# Altium schematic sheet MCS_adapter.SchDoc
size A4
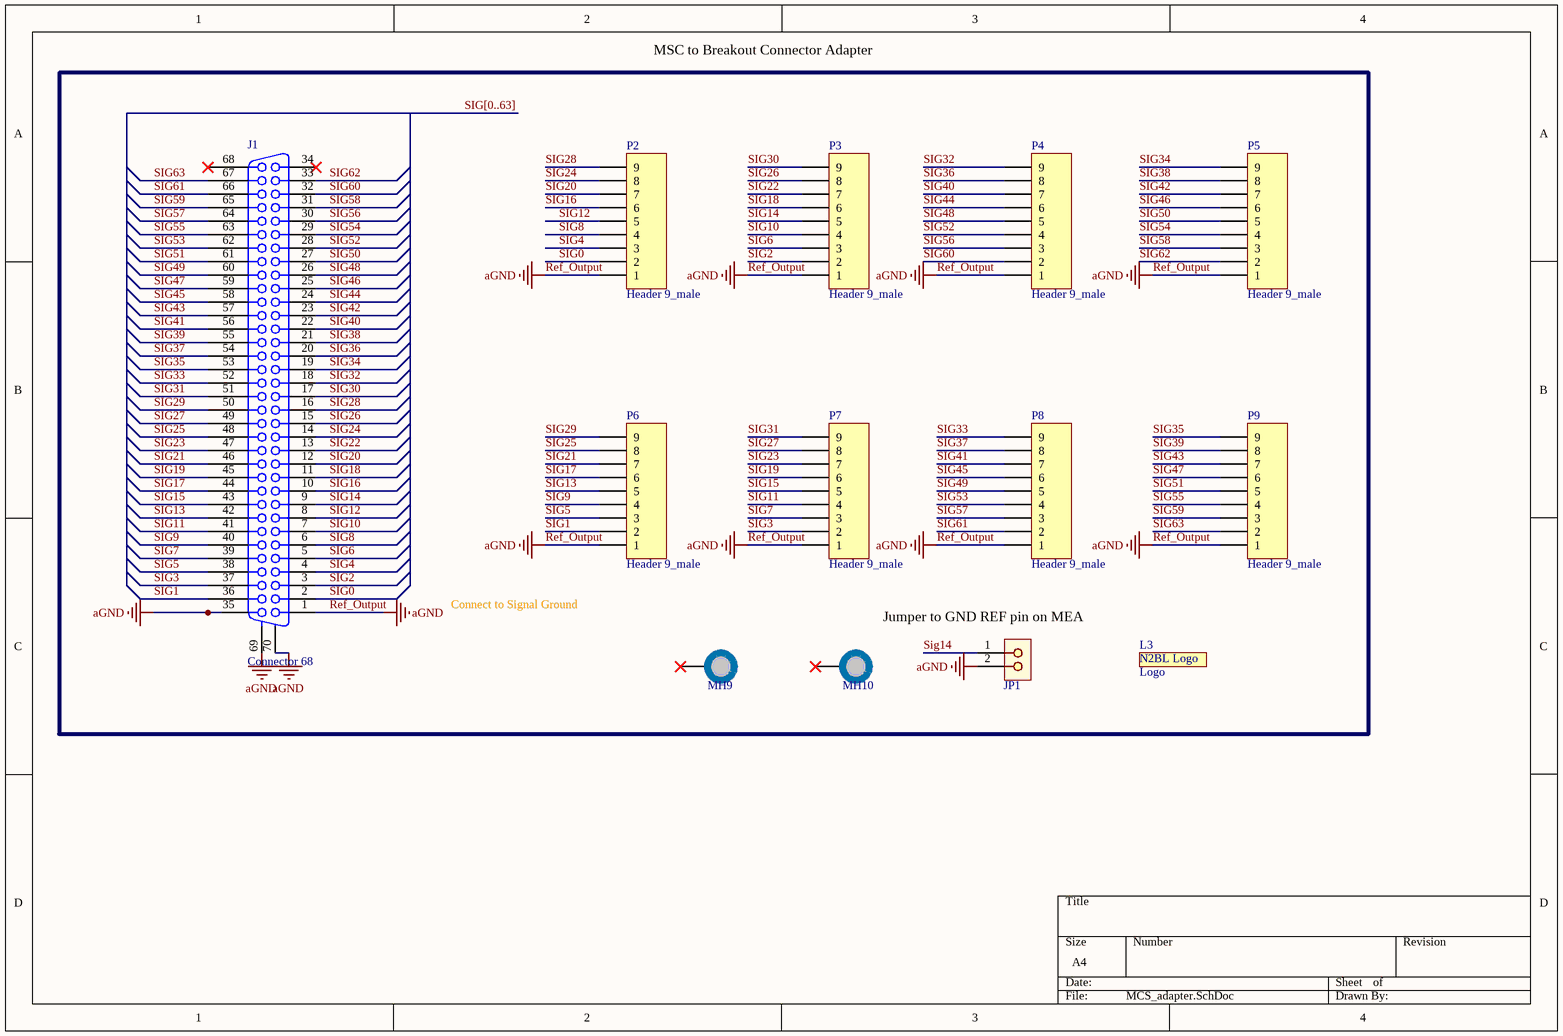
[diagram p0: MCS_adapter.SchDoc]

## Parts
J1  Connector 68  [CONN_2-5174339-5_2-5174339-5(Primary)]
JP1  01x02  [HDR1X2]  (value not drawn)
L3  Logo  [N2BL_LOGO]
MH9  MH_7.4MMC_3.2MMD  [MH_7.4MMD_3.2MMD]  (value not drawn)  (no BOM)
MH10  MH_7.4MMC_3.2MMD  [MH_7.4MMD_3.2MMD]  (value not drawn)  (no BOM)
P2  Header 9_male  [TE_3-644456-9]
P3  Header 9_male  [TE_3-644456-9]
P4  Header 9_male  [TE_3-644456-9]
P5  Header 9_male  [TE_3-644456-9]
P6  Header 9_male  [TE_3-644456-9]
P7  Header 9_male  [TE_3-644456-9]
P8  Header 9_male  [TE_3-644456-9]
P9  Header 9_male  [TE_3-644456-9]

## Nets
Ref_Output: J1.1 J1.35 J1.69(MH1) J1.70(MH2) JP1.2 P2.1 P3.1 P4.1 P5.1 P6.1 P7.1 P8.1 P9.1  [also labelled aGND]
SIG0: J1.2 P2.2
SIG1: J1.36 P6.2
SIG2: J1.3 P3.2
SIG3: J1.37 P7.2
SIG4: J1.4 P2.3
SIG5: J1.38 P6.3
SIG6: J1.5 P3.3
SIG7: J1.39 P7.3
SIG8: J1.6 P2.4
SIG9: J1.40 P6.4
SIG10: J1.7 P3.4
SIG11: J1.41 P7.4
SIG12: J1.8 P2.5
SIG13: J1.42 P6.5
SIG14: J1.9 JP1.1 P3.5
SIG15: J1.43 P7.5
SIG16: J1.10 P2.6
SIG17: J1.44 P6.6
SIG18: J1.11 P3.6
SIG19: J1.45 P7.6
SIG20: J1.12 P2.7
SIG21: J1.46 P6.7
SIG22: J1.13 P3.7
SIG23: J1.47 P7.7
SIG24: J1.14 P2.8
SIG25: J1.48 P6.8
SIG26: J1.15 P3.8
SIG27: J1.49 P7.8
SIG28: J1.16 P2.9
SIG29: J1.50 P6.9
SIG30: J1.17 P3.9
SIG31: J1.51 P7.9
SIG32: J1.18 P4.9
SIG33: J1.52 P8.9
SIG34: J1.19 P5.9
SIG35: J1.53 P9.9
SIG36: J1.20 P4.8
SIG37: J1.54 P8.8
SIG38: J1.21 P5.8
SIG39: J1.55 P9.8
SIG40: J1.22 P4.7
SIG41: J1.56 P8.7
SIG42: J1.23 P5.7
SIG43: J1.57 P9.7
SIG44: J1.24 P4.6
SIG45: J1.58 P8.6
SIG46: J1.25 P5.6
SIG47: J1.59 P9.6
SIG48: J1.26 P4.5
SIG49: J1.60 P8.5
SIG50: J1.27 P5.5
SIG51: J1.61 P9.5
SIG52: J1.28 P4.4
SIG53: J1.62 P8.4
SIG54: J1.29 P5.4
SIG55: J1.63 P9.4
SIG56: J1.30 P4.3
SIG57: J1.64 P8.3
SIG58: J1.31 P5.3
SIG59: J1.65 P9.3
SIG60: J1.32 P4.2
SIG61: J1.66 P8.2
SIG62: J1.33 P5.2
SIG63: J1.67 P9.2

Not connected (* = marked no-connect by the designer): J1 34* 68*; MH9 1*; MH10 1*

## Buses and harness runs
bus SIG[0..63]

## Notes on the sheet
- MSC to Breakout Connector Adapter
- Connect to Signal Ground
- (near JP1) Jumper to GND REF pin on MEA
- (in symbol Neuron To Brain Lab Logo) N2BL Logo

## Library data of the parts
J1 = Connector 68: Receptacle Header Assemby; Manufacturer: TE Connectivity; ManufacturerPartNumber: 2-5174339-5; Pricing1: 1=29.61;  10=26.727;  25=25.60760;  50=24.007  (CAD); Supplier 1: Digi-Key; ComponentLink1Description: Datasheet; ComponentLink1URL: https://www.te.com/commerce/DocumentDelivery/DDEController?Action=srchrtrv&DocNm=5174339&DocType=Customer+Drawing&DocLang=English; Stock1: 1335; Supplier Link 1: https://www.digikey.ca/product-detail/en/te-connectivity-amp-connectors/2-5174339-5/A121355-ND/1835651; Manufacturer Link: https://www.te.com/usa-en/product-2-5174339-5.html#pdp-docs-features; Supplier Part Number 1: A121355-ND
JP1 = 01x02: 01X02 generic terminal connector
L3 = Neuron To Brain Lab Logo
MH9 MH10 = MH_7.4MMC_3.2MMC: Mounting Hole 7.4mm Diameter, 3.2mm Drill
P2-P9 = Header 9_male: Header, 9-Pin; Manufacturer: TE Connectivity AMP Connectors; Manufacturer Part Number: 3-644456-9; Manufacturer Link: https://www.te.com/global-en/product-3-644456-9.html; Supplier 1: Digikey; Supplier Link 1: https://www.digikey.ca/product-detail/en/te-connectivity-amp-connectors/3-644456-9/A31119-ND/698351; Supplier Part Number 1: A31119-ND; Stock1: 6,446; Price1: 1=0.81000;  10=0.76300;  100=0.58520;  500=0.50888;  1,000=0.41984;  5,000=0.36894;  10,000=0.34350 (CAD); ComponentLink1URL: https://www.te.com/commerce/DocumentDelivery/DDEController?Action=srchrtrv&DocNm=644456&DocType=Customer+Drawing&DocLang=English; ComponentLink1Description: Datasheet